# Altium schematic sheet DIOT_Template.SchDoc: =DocumentName
size A3; DocumentNumber: 1; Revision: 0; SheetNumber: 1; SheetTotal: 18
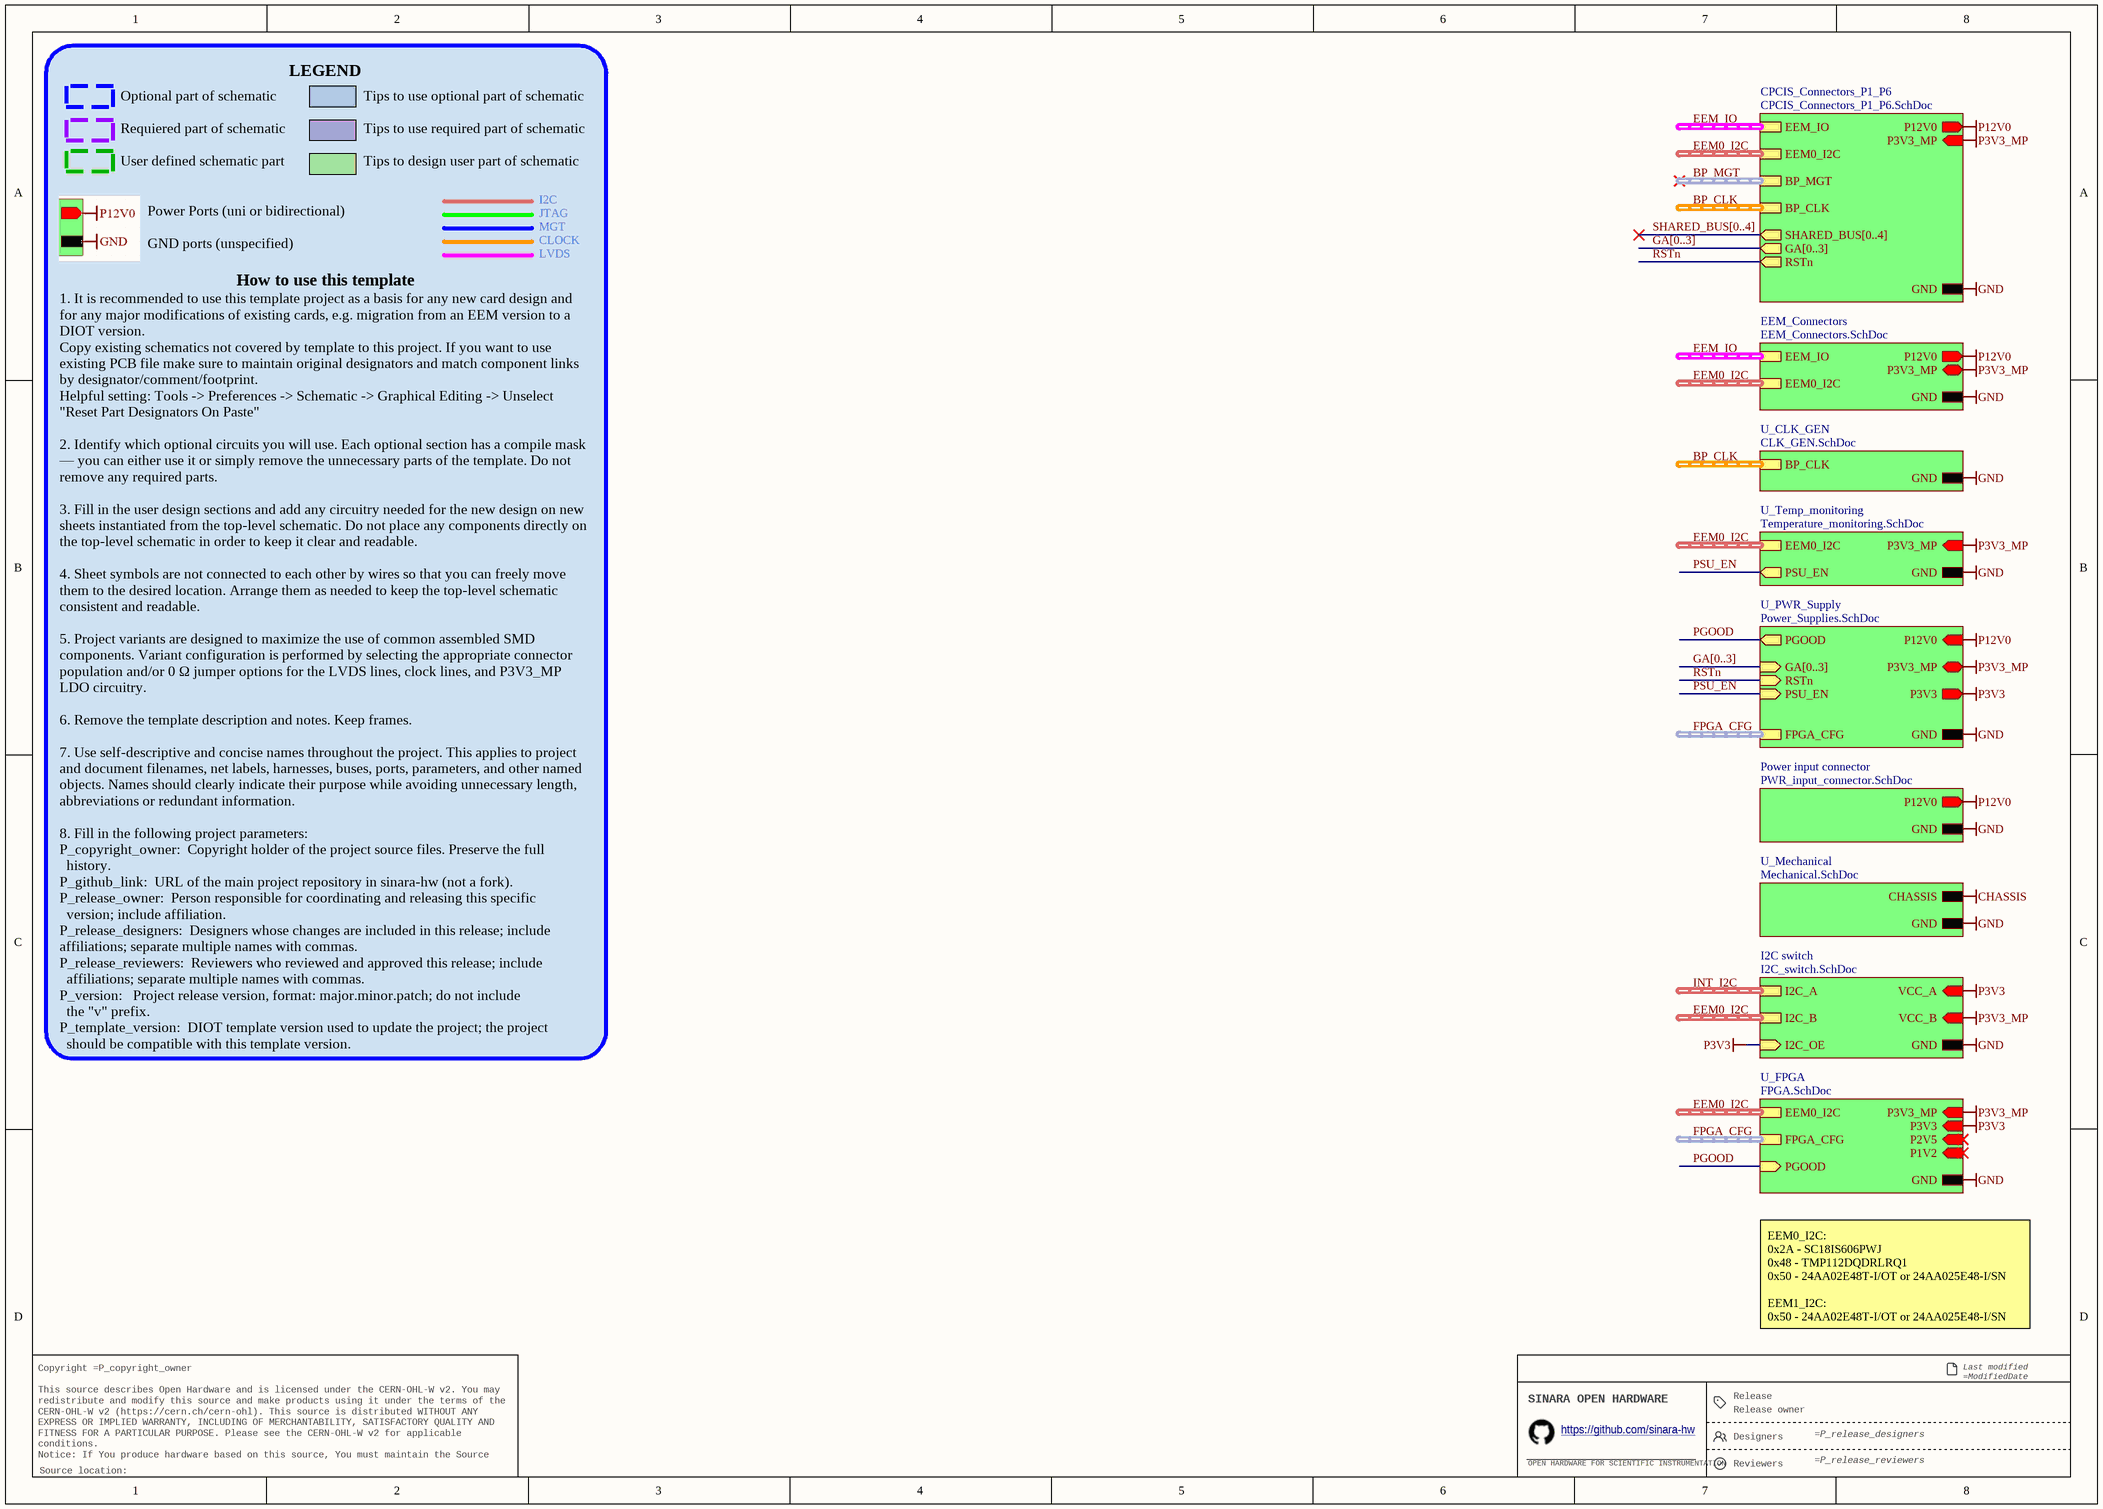
[diagram p0: DIOT_Template.SchDoc]

## Sub-sheets
CPCIS_Connectors_P1_P6 = CPCIS_Connectors_P1_P6.SchDoc: P12V0 (out), P3V3_MP (in), EEM_IO (harness EEM_LVDS), EEM0_I2C (harness I2C), BP_MGT (harness MGT), BP_CLK (harness CLK_DIFF), SHARED_BUS[0..4] (out), GA[0..3] (out), GND, RSTn (out)
EEM_Connectors = EEM_Connectors.SchDoc: P3V3_MP (bidir), P12V0 (out), EEM_IO (harness EEM_LVDS), EEM0_I2C (harness I2C), GND
I2C switch = I2C_switch.SchDoc: I2C_A (harness I2C), I2C_B (harness I2C), I2C_OE (in), GND, VCC_A (in), VCC_B (in)
Power input connector = PWR_input_connector.SchDoc: P12V0 (out), GND
U_CLK_GEN = CLK_GEN.SchDoc: GND, BP_CLK (harness CLK_DIFF)
U_FPGA = FPGA.SchDoc: EEM0_I2C (harness I2C), P1V2 (in), P2V5 (in), P3V3 (in), P3V3_MP (in), GND, PGOOD (in), FPGA_CFG (harness FPGA_CFG)
U_Mechanical = Mechanical.SchDoc: CHASSIS, GND
U_PWR_Supply = Power_Supplies.SchDoc: GND, P12V0 (in), P3V3 (out), P3V3_MP (bidir), PGOOD (out), GA[0..3] (in), RSTn (in), PSU_EN (in), FPGA_CFG (harness FPGA_CFG)
U_Temp_monitoring = Temperature_monitoring.SchDoc: GND, P3V3_MP (in), EEM0_I2C (harness I2C), PSU_EN (out)

## Nets
CHASSIS: sheet U_Mechanical/CHASSIS
GND: sheet U_PWR_Supply/GND, sheet CPCIS_Connectors_P1_P6/GND, sheet EEM_Connectors/GND, sheet U_CLK_GEN/GND, sheet U_Temp_monitoring/GND, sheet Power input connector/GND, sheet U_Mechanical/GND, sheet I2C switch/GND, sheet U_FPGA/GND
P3V3: sheet U_PWR_Supply/P3V3, sheet I2C switch/I2C_OE, sheet I2C switch/VCC_A, sheet U_FPGA/P3V3
P3V3_MP: sheet U_PWR_Supply/P3V3_MP, sheet CPCIS_Connectors_P1_P6/P3V3_MP, sheet EEM_Connectors/P3V3_MP, sheet U_Temp_monitoring/P3V3_MP, sheet I2C switch/VCC_B, sheet U_FPGA/P3V3_MP
P12V0: sheet U_PWR_Supply/P12V0, sheet CPCIS_Connectors_P1_P6/P12V0, sheet EEM_Connectors/P12V0, sheet Power input connector/P12V0
PGOOD: sheet U_PWR_Supply/PGOOD, sheet U_FPGA/PGOOD
PSU_EN: sheet U_PWR_Supply/PSU_EN, sheet U_Temp_monitoring/PSU_EN
RSTn: sheet U_PWR_Supply/RSTn, sheet CPCIS_Connectors_P1_P6/RSTn

## Buses and harness runs
bus GA[0..3] = sheet CPCIS_Connectors_P1_P6/GA[0..3]
bus GA[0..3] = sheet U_PWR_Supply/GA[0..3]
bus SHARED_BUS[0..4] = sheet CPCIS_Connectors_P1_P6/SHARED_BUS[0..4]
harness BP_CLK = sheet CPCIS_Connectors_P1_P6/BP_CLK
harness BP_CLK = sheet U_CLK_GEN/BP_CLK
harness BP_MGT = sheet CPCIS_Connectors_P1_P6/BP_MGT
harness EEM0_I2C = sheet CPCIS_Connectors_P1_P6/EEM0_I2C
harness EEM0_I2C = sheet EEM_Connectors/EEM0_I2C
harness EEM0_I2C = sheet I2C switch/I2C_B
harness EEM0_I2C = sheet U_FPGA/EEM0_I2C
harness EEM0_I2C = sheet U_Temp_monitoring/EEM0_I2C
harness EEM_IO = sheet CPCIS_Connectors_P1_P6/EEM_IO
harness EEM_IO = sheet EEM_Connectors/EEM_IO
harness FPGA_CFG = sheet U_FPGA/FPGA_CFG
harness FPGA_CFG = sheet U_PWR_Supply/FPGA_CFG
harness INT_I2C = sheet I2C switch/I2C_A

## Notes on the sheet
- LEGEND
- Optional part of schematic
  Requiered part of schematic
  User defined schematic part
- Tips to use optional part of schematic
  Tips to use required part of schematic
  Tips to design user part of schematic
- I2C
- JTAG
- MGT
- CLOCK
- How to use this template
- Power Ports (uni or bidirectional)
  GND ports (unspecified)
- LVDS
- 1. It is recommended to use this template project as a basis for any new card design and for any major modifications of existing cards, e.g. migration from an EEM version to a DIOT version.
  Copy existing schematics not covered by template to this project. If you want to use existing PCB file make sure to maintain original designators and match component links by designator/comment/footprint.
  Helpful setting: Tools -> Preferences -> Schematic -> Graphical Editing -> Unselect "Reset Part Designators On Paste"
  2. Identify which optional circuits you will use. Each optional section has a compile mask — you can either use it or simply remove the unnecessary parts of the template. Do not remove any required parts.
  3. Fill in the user design sections and add any circuitry needed for the new design on new sheets instantiated from the top-level schematic. Do not place any components directly on the top-level schematic in order to keep it clear and readable.
  4. Sheet symbols are not connected to each other by wires so that you can freely move them to the desired location. Arrange them as needed to keep the top-level schematic consistent and readable.
  5. Project variants are designed to maximize the use of common assembled SMD components. Variant configuration is performed by selecting the appropriate connector population and/or 0 Ω jumper options for the LVDS lines, clock lines, and P3V3_MP LDO circuitry.
  6. Remove the template description and notes. Keep frames.
  7. Use self-descriptive and concise names throughout the project. This applies to project and document filenames, net labels, harnesses, buses, ports, parameters, and other named objects. Names should clearly indicate their purpose while avoiding unnecessary length, abbreviations or redundant information.
  8. Fill in the following project parameters:
  P_copyright_owner: 	Copyright holder of the project source files. Preserve the full
  history.
  P_github_link: 	URL of the main project repository in sinara-hw (not a fork).
  P_release_owner: 	Person responsible for coordinating and releasing this specific
  version; include affiliation.
  P_release_designers: 	Designers whose changes are included in this release; include 				affiliations; separate multiple names with commas.
  P_release_reviewers: 	Reviewers who reviewed and approved this release; include
  affiliations; separate multiple names with commas.
  P_version: 		Project release version, format: major.minor.patch; do not include
  the "v" prefix.
  P_template_version: 	DIOT template version used to update the project; the project
  should be compatible with this template version.
- EEM0_I2C:
  0x2A - SC18IS606PWJ
  0x48 - TMP112DQDRLRQ1
  0x50 - 24AA02E48T-I/OT or 24AA025E48-I/SN
  EEM1_I2C:
  0x50 - 24AA02E48T-I/OT or 24AA025E48-I/SN
- Release
- Last modified =ModifiedDate
  Sheet =sheetnumber of =sheettotal · Size A3
- Copyright =P_copyright_owner
  This source describes Open Hardware and is licensed under the CERN-OHL-W v2. You may redistribute and modify this source and make products using it under the terms of the CERN-OHL-W v2 (https://cern.ch/cern-ohl). This source is distributed WITHOUT ANY EXPRESS OR IMPLIED WARRANTY, INCLUDING OF MERCHANTABILITY, SATISFACTORY QUALITY AND FITNESS FOR A PARTICULAR PURPOSE. Please see the CERN-OHL-W v2 for applicable conditions.
  Notice: If You produce hardware based on this source, You must maintain the Source Location visible on the product, its packaging or its documentation.
- SINARA OPEN HARDWARE
- OPEN HARDWARE FOR SCIENTIFIC INSTRUMENTATION
- https://github.com/sinara-hw
- Release owner
- Designers
- Reviewers
- Source location: